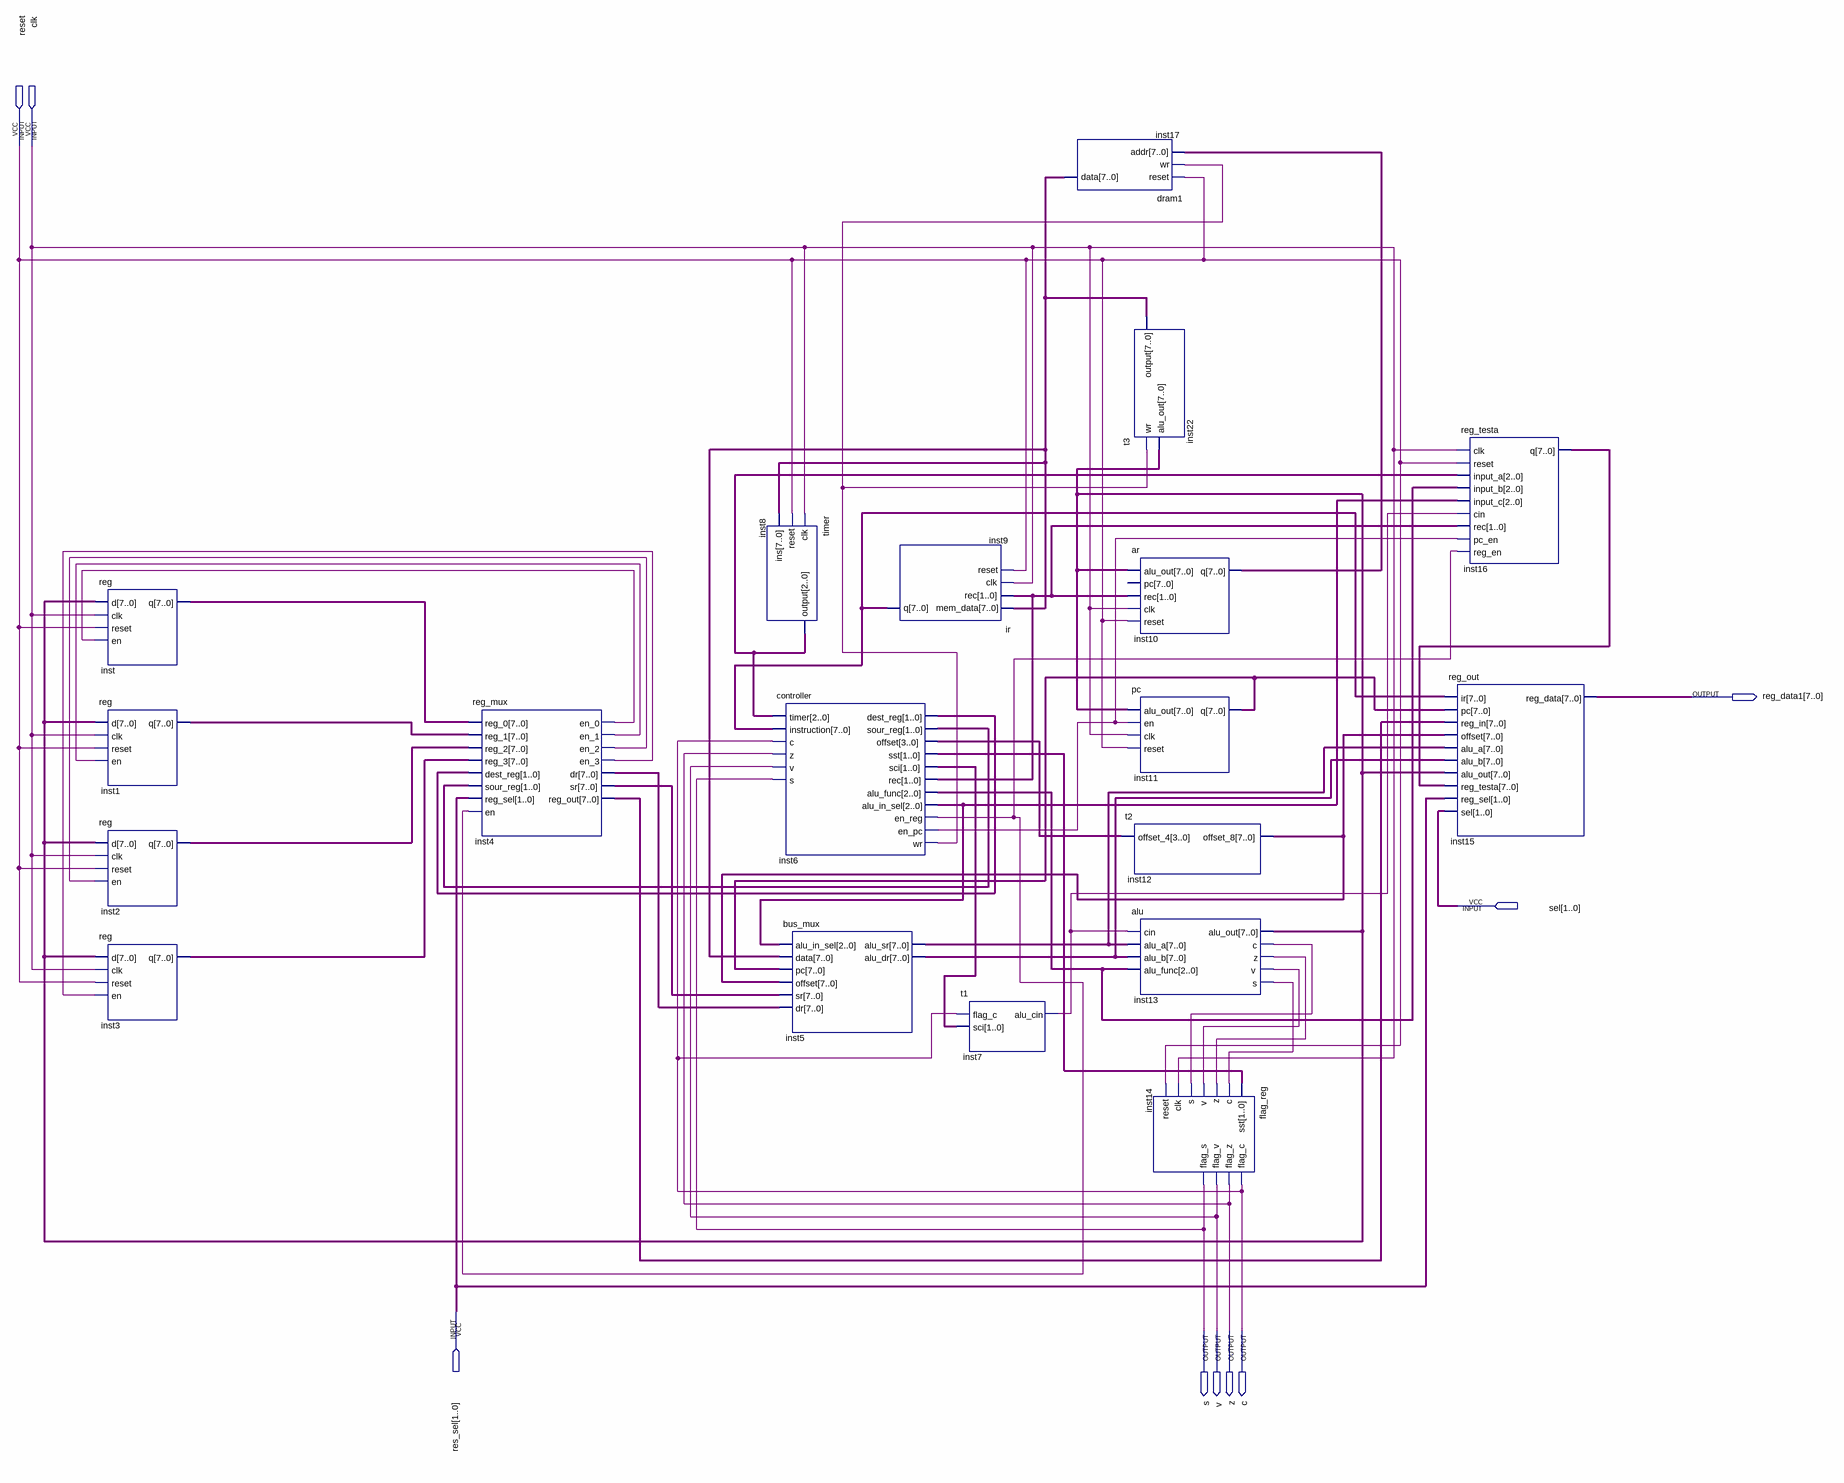
[diagram p0: schematic sheet]
// Quartus schematic cpu1.bdf as structural Verilog: 19 symbols, 9 pins
module cpu1 (
  input  reset,
  input  clk,
  input  [1:0] sel,
  input  [1:0] res_sel,
  output [7:0] reg_data1,
  output s,
  output v,
  output z,
  output c
);

  wire inst4_en_0, inst4_en_1, inst4_en_2, inst4_en_3, inst6_en_pc, inst6_en_reg, inst6_wr, inst7_alu_cin,
       inst13_c, inst13_s, inst13_v, inst13_z;
  wire [1:0] inst6_dest_reg, inst6_rec, inst6_sci, inst6_sour_reg, inst6_sst;
  wire [2:0] inst6_alu_func, inst6_alu_in_sel, inst8_output;
  wire [3:0] inst6_offset;
  wire [7:0] inst1_q, inst2_q, inst3_q, inst4_dr, inst4_reg_out, inst4_sr, inst5_alu_dr, inst5_alu_sr,
       inst9_q, inst10_q, inst11_q, inst12_offset_8, inst13_alu_out, inst16_q, inst17_data, inst_q;

  \reg  inst (.d(inst13_alu_out), .clk(clk), .reset(reset), .en(inst4_en_0), .q(inst_q));
  \reg  inst1 (.d(inst13_alu_out), .clk(clk), .reset(reset), .en(inst4_en_1), .q(inst1_q));
  \reg  inst2 (.d(inst13_alu_out), .clk(clk), .reset(reset), .en(inst4_en_2), .q(inst2_q));
  \reg  inst3 (.d(inst13_alu_out), .clk(clk), .reset(reset), .en(inst4_en_3), .q(inst3_q));
  reg_mux inst4 (
    .reg_0(inst_q), .reg_1(inst1_q), .reg_2(inst2_q), .reg_3(inst3_q), .dest_reg(inst6_dest_reg),
    .sour_reg(inst6_sour_reg), .reg_sel(res_sel), .en(inst6_en_reg), .en_0(inst4_en_0), .en_1(inst4_en_1),
    .en_2(inst4_en_2), .en_3(inst4_en_3), .dr(inst4_dr), .sr(inst4_sr), .reg_out(inst4_reg_out));
  timer inst8 (.clk(clk), .reset(reset), .ins(inst17_data), .\output (inst8_output));
  controller inst6 (
    .timer(inst8_output), .instruction(inst9_q), .c(c), .z(z), .v(v), .s(s), .dest_reg(inst6_dest_reg),
    .sour_reg(inst6_sour_reg), .offset(inst6_offset), .sst(inst6_sst), .sci(inst6_sci), .rec(inst6_rec),
    .alu_func(inst6_alu_func), .alu_in_sel(inst6_alu_in_sel), .en_reg(inst6_en_reg), .en_pc(inst6_en_pc),
    .wr(inst6_wr));
  bus_mux inst5 (
    .alu_in_sel(inst6_alu_in_sel), .data(inst17_data), .pc(inst11_q), .offset(inst12_offset_8),
    .sr(inst4_sr), .dr(inst4_dr), .alu_sr(inst5_alu_sr), .alu_dr(inst5_alu_dr));
  ir inst9 (.mem_data(inst17_data), .rec(inst6_rec), .clk(clk), .reset(reset), .q(inst9_q));
  t1 inst7 (.flag_c(c), .sci(inst6_sci), .alu_cin(inst7_alu_cin));
  dram1 inst17 (.reset(reset), .wr(inst6_wr), .addr(inst10_q), .data(inst17_data));
  t3 inst22 (.wr(inst6_wr), .alu_out(inst13_alu_out), .\output (inst17_data));
  ar inst10 (.alu_out(inst13_alu_out), .rec(inst6_rec), .clk(clk), .reset(reset), .q(inst10_q));  // open: pc
  pc inst11 (.alu_out(inst13_alu_out), .en(inst6_en_pc), .clk(clk), .reset(reset), .q(inst11_q));
  t2 inst12 (.offset_4(inst6_offset), .offset_8(inst12_offset_8));
  alu inst13 (
    .cin(inst7_alu_cin), .alu_a(inst5_alu_sr), .alu_b(inst5_alu_dr), .alu_func(inst6_alu_func),
    .alu_out(inst13_alu_out), .c(inst13_c), .z(inst13_z), .v(inst13_v), .s(inst13_s));
  flag_reg inst14 (
    .sst(inst6_sst), .c(inst13_s), .z(inst13_z), .v(inst13_v), .s(inst13_c), .clk(clk), .reset(reset),
    .flag_c(c), .flag_z(z), .flag_v(v), .flag_s(s));
  reg_testa inst16 (
    .clk(clk), .reset(reset), .input_a(inst8_output), .input_b(inst6_alu_func), .input_c(inst6_alu_in_sel),
    .cin(inst7_alu_cin), .rec(inst6_rec), .pc_en(inst6_en_pc), .reg_en(inst6_en_reg), .q(inst16_q));
  reg_out inst15 (
    .ir(inst9_q), .pc(inst11_q), .reg_in(inst4_reg_out), .offset(inst12_offset_8), .alu_a(inst5_alu_sr),
    .alu_b(inst5_alu_dr), .alu_out(inst13_alu_out), .reg_testa(inst16_q), .reg_sel(res_sel), .sel(sel),
    .reg_data(reg_data1));
endmodule
